# Altium schematic sheet Sheet1.SchDoc
size A4
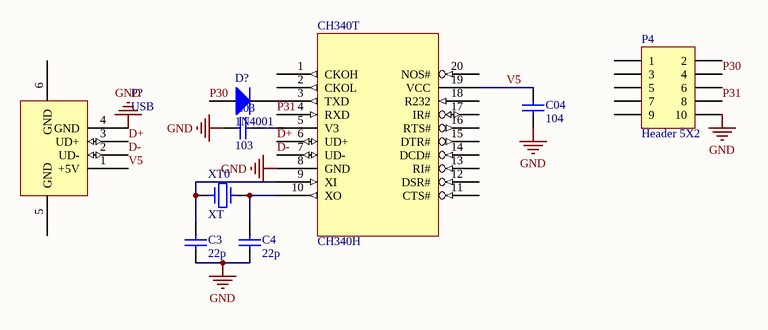
[diagram p0: Sheet1.SchDoc]

## Parts
C3  value 22p  [C-RAD-0805]  (hidden comment: Cap)
C03  value 103  [C-RAD-0805]  (hidden comment: Cap)
C4  value 22p  [C-RAD-0805]  (hidden comment: Cap)
C04  value 104  [C-RAD-0805]  (hidden comment: Cap)
CH340T  CH340H  [SSOP20]
D?  Type: 1N4001  [DIODE-1206]  (hidden comment: Diode)
P4  Header 5X2  [HDR5X2_A1]
P?  USB  [USB-A]
XT0  XT  [HC-49S]

## Nets
GND: C03.1 C3.2 C04.1 C4.2 CH340T.8(GND) P4.10 P?.4(GND)
D+: CH340T.6(UD+) P?.3(UD+)
D-: CH340T.7(UD-) P?.2(UD-)
P30: D?.1(A) P4.4
P31: CH340T.4(RXD) P4.8
V5: C04.2 CH340T.19(VCC) P?.1(+5V)
NetC3_1: C3.1 CH340T.9(XI) XT0.2
NetC03_2: C03.2 CH340T.5(V3)
NetC4_1: C4.1 CH340T.10(XO) XT0.1
NetCH340T_3: CH340T.3(TXD) D?.2(K)

Not connected (* = marked no-connect by the designer): CH340T 1(CKOH) 2(CKOL) 11(CTS#) 12(DSR#) 13(RI#) 14(DCD#) 15(DTR#) 16(RTS#) 17(IR#) 18(R232) 20(NOS#); P4 1 2 3 5 6 7 9; P? 5(GND) 6(GND)

## Library data of the parts
C3 C03 C4 C04 = Cap: 无极性电容; Published: 8-Jun-2000; LatestRevisionDate: 17-Jul-2002; LatestRevisionNote: Re-released for DXP Platform.; PackageReference: RAD-0.3; Publisher: Altium Limited
CH340T = CH340H: USB to TTL Serial / UART,  USB to IrDA
D? = Diode: 二极管; Published: 8-Jun-2000; LatestRevisionDate: 17-Jul-2002; LatestRevisionNote: Re-released for DXP Platform.; PackageDocument: Sep-1996; PackageReference: SMC; Publisher: Altium Limited; Code_JEDEC: DO-214-AB
P4 = Header 5X2: 接插件; LatestRevisionDate: 17-Jul-2002; LatestRevisionNote: Re-released for DXP Platform.; Publisher: Altium Limited
P? = USB: USB Port
XT0 = XT: 晶振